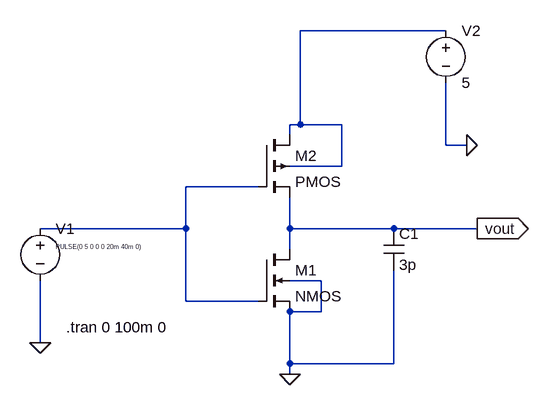
[diagram p0: schematic CMOS inverter Characteristics.asc]
CMOS inverter Characteristics.asc, the LTspice schematic file:
Version 4.1
SHEET 1 880 680
WIRE 464 -160 240 -160
WIRE 240 -16 240 -160
WIRE 240 -16 224 -16
WIRE 304 -16 240 -16
WIRE 224 0 224 -16
WIRE 464 16 464 -80
WIRE 496 16 464 16
WIRE 304 48 304 -16
WIRE 304 48 224 48
WIRE 176 80 64 80
WIRE 64 144 64 80
WIRE 64 144 -160 144
WIRE 224 144 224 96
WIRE 384 144 224 144
WIRE 512 144 384 144
WIRE 224 176 224 144
WIRE 272 224 224 224
WIRE 64 256 64 144
WIRE 176 256 64 256
WIRE 224 272 224 256
WIRE 272 272 272 224
WIRE 272 272 224 272
WIRE -160 320 -160 224
WIRE 224 352 224 272
WIRE 384 352 384 208
WIRE 384 352 224 352
WIRE 224 368 224 352
FLAG -160 320 0
FLAG 224 368 0
FLAG 496 16 0
FLAG 512 144 vout
IOPIN 512 144 Out
SYMBOL nmos4 176 176 R0
SYMATTR InstName M1
SYMBOL pmos4 176 0 R0
SYMATTR InstName M2
SYMBOL voltage -160 128 R0
WINDOW 123 0 0 Left 0
WINDOW 39 0 0 Left 0
WINDOW 3 24 44 Left 0
SYMATTR InstName V1
SYMATTR Value PULSE(0 5 0 0 0 20m 40m 0)
SYMBOL voltage 464 -176 R0
WINDOW 123 0 0 Left 0
WINDOW 39 0 0 Left 0
SYMATTR InstName V2
SYMATTR Value 5
SYMBOL cap 368 144 R0
SYMATTR InstName C1
SYMATTR Value 3p
TEXT -120 296 Left 2 !.tran 0 100m 0

The netlist it stands for:
* CMOS inverter Characteristics.asc
M1 vout N002 0 0 NMOS
M2 N001 N002 vout N001 PMOS
V1 N002 0 PULSE(0 5 0 0 0 20m 40m 0)
V2 N001 0 5
C1 vout 0 3p
.model NMOS NMOS
.model PMOS PMOS
.lib standard.mos
.tran 0 100m 0
.backanno
.end